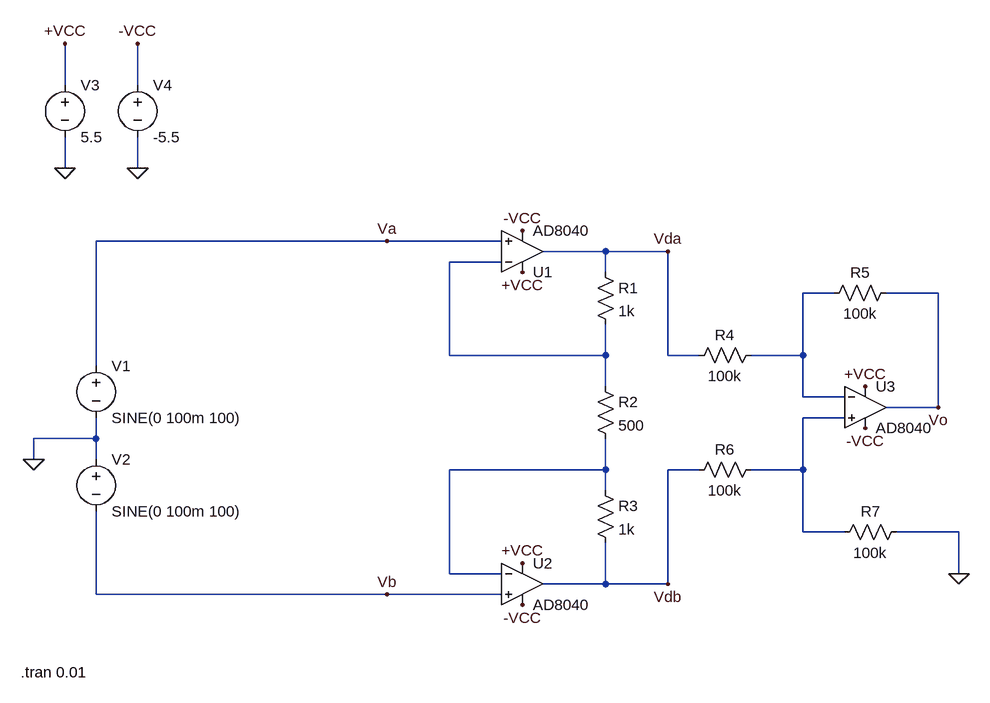
[diagram p0: schematic InstOpAmp_Test.asc]
InstOpAmp_Test.asc, the LTspice schematic file:
Version 4
SHEET 1 1284 680
WIRE -112 -352 -112 -416
WIRE 0 -352 0 -416
WIRE -112 -224 -112 -272
WIRE 0 -224 0 -272
WIRE 384 -112 -64 -112
WIRE 560 -112 384 -112
WIRE 720 -96 624 -96
WIRE 816 -96 720 -96
WIRE 560 -80 480 -80
WIRE 720 -64 720 -96
WIRE 1072 -32 1024 -32
WIRE 1232 -32 1152 -32
WIRE 480 64 480 -80
WIRE 720 64 720 16
WIRE 720 64 480 64
WIRE 816 64 816 -96
WIRE 864 64 816 64
WIRE 1024 64 1024 -32
WIRE 1024 64 944 64
WIRE -64 80 -64 -112
WIRE 720 112 720 64
WIRE 1024 128 1024 64
WIRE 1088 128 1024 128
WIRE 1232 144 1232 -32
WIRE 1232 144 1152 144
WIRE 1088 160 1024 160
WIRE -64 192 -64 160
WIRE -64 192 -160 192
WIRE -160 224 -160 192
WIRE -64 224 -64 192
WIRE 720 240 720 192
WIRE 720 240 480 240
WIRE 864 240 816 240
WIRE 1024 240 1024 160
WIRE 1024 240 944 240
WIRE 720 272 720 240
WIRE 1024 336 1024 240
WIRE 1088 336 1024 336
WIRE 1264 336 1168 336
WIRE 480 400 480 240
WIRE 560 400 480 400
WIRE 1264 400 1264 336
WIRE 720 416 720 352
WIRE 720 416 624 416
WIRE 816 416 816 240
WIRE 816 416 720 416
WIRE -64 432 -64 304
WIRE 384 432 -64 432
WIRE 560 432 384 432
FLAG -160 224 0
FLAG -112 -224 0
FLAG 0 -224 0
FLAG -112 -416 +VCC
FLAG 0 -416 -VCC
FLAG 592 -64 +VCC
FLAG 592 -128 -VCC
FLAG 592 384 +VCC
FLAG 592 448 -VCC
FLAG 1120 112 +VCC
FLAG 1120 176 -VCC
FLAG 1264 400 0
FLAG 384 -112 Va
FLAG 384 432 Vb
FLAG 816 -96 Vda
FLAG 816 416 Vdb
FLAG 1232 144 Vo
SYMBOL voltage -64 64 R0
WINDOW 123 0 0 Left 0
WINDOW 39 0 0 Left 0
SYMATTR InstName V1
SYMATTR Value SINE(0 100m 100)
SYMBOL voltage -64 208 R0
WINDOW 123 0 0 Left 0
WINDOW 39 0 0 Left 0
SYMATTR InstName V2
SYMATTR Value SINE(0 100m 100)
SYMBOL OpAmps\\AD8040 592 -32 M180
SYMATTR InstName U1
SYMBOL voltage -112 -368 R0
WINDOW 123 0 0 Left 0
WINDOW 39 0 0 Left 0
SYMATTR InstName V3
SYMATTR Value 5.5
SYMBOL voltage 0 -368 R0
WINDOW 123 0 0 Left 0
WINDOW 39 0 0 Left 0
SYMATTR InstName V4
SYMATTR Value -5.5
SYMBOL OpAmps\\AD8040 592 352 R0
SYMATTR InstName U2
SYMBOL res 704 -80 R0
SYMATTR InstName R1
SYMATTR Value 1k
SYMBOL res 704 96 R0
SYMATTR InstName R2
SYMATTR Value 500
SYMBOL res 704 256 R0
SYMATTR InstName R3
SYMATTR Value 1k
SYMBOL OpAmps\\AD8040 1120 80 R0
SYMATTR InstName U3
SYMBOL res 960 48 R90
WINDOW 0 0 56 VBottom 2
WINDOW 3 32 56 VTop 2
SYMATTR InstName R4
SYMATTR Value 100k
SYMBOL res 1168 -48 R90
WINDOW 0 0 56 VBottom 2
WINDOW 3 32 56 VTop 2
SYMATTR InstName R5
SYMATTR Value 100k
SYMBOL res 960 224 R90
WINDOW 0 0 56 VBottom 2
WINDOW 3 32 56 VTop 2
SYMATTR InstName R6
SYMATTR Value 100k
SYMBOL res 1184 320 R90
WINDOW 0 0 56 VBottom 2
WINDOW 3 32 56 VTop 2
SYMATTR InstName R7
SYMATTR Value 100k
TEXT -180 552 Left 2 !.tran 0.01

The netlist it stands for:
* InstOpAmp_Test.asc
V1 Va 0 SINE(0 100m 100)
V2 0 Vb SINE(0 100m 100)
XU1 Va N001 +VCC -VCC Vda AD8040  ; pins In+ In- V+ V- OUT
V3 +VCC 0 5.5
V4 -VCC 0 -5.5
XU2 Vb N004 +VCC -VCC Vdb AD8040  ; pins In+ In- V+ V- OUT
R1 Vda N001 1k
R2 N001 N004 500
R3 N004 Vdb 1k
XU3 N003 N002 +VCC -VCC Vo AD8040  ; pins In+ In- V+ V- OUT
R4 N002 Vda 100k
R5 Vo N002 100k
R6 N003 Vdb 100k
R7 0 N003 100k
.tran 0.01
.backanno
.end